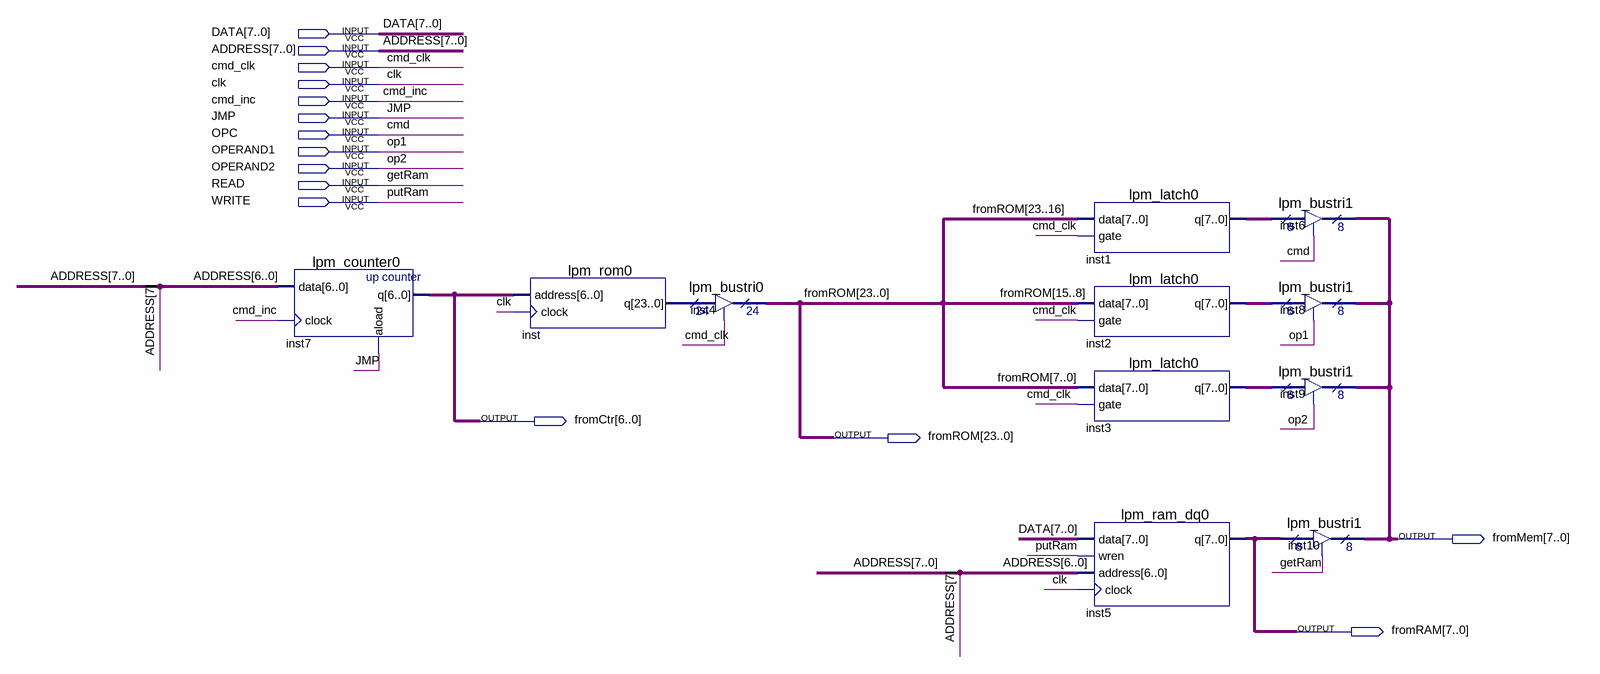
[diagram p0: schematic sheet]
// Quartus schematic mem.bdf as structural Verilog: 11 symbols, 15 pins
module mem (
  input  [7:0] DATA,
  input  [7:0] ADDRESS,
  input  cmd_clk,
  input  clk,
  input  cmd_inc,
  input  JMP,
  input  OPC,
  input  OPERAND1,
  input  OPERAND2,
  input  READ,
  input  WRITE,
  output [6:0] fromCtr,
  output [23:0] fromROM,
  output [7:0] fromMem,
  output [7:0] fromRAM
);

  wire [7:0] inst1_q, inst2_q, inst3_q;
  wire [23:0] inst_q;

  lpm_counter0 inst7 (.data(ADDRESS[6:0]), .clock(cmd_inc), .aload(JMP), .q(fromCtr));
  lpm_rom0 inst (.address(fromCtr), .clock(clk), .q(inst_q));
  lpm_bustri0 inst4 (.enabledt(cmd_clk), .data(inst_q), .tridata(fromROM));
  lpm_latch0 inst1 (.data(fromROM[23:16]), .gate(cmd_clk), .q(inst1_q));
  lpm_latch0 inst2 (.data(fromROM[15:8]), .gate(cmd_clk), .q(inst2_q));
  lpm_latch0 inst3 (.data(fromROM[7:0]), .gate(cmd_clk), .q(inst3_q));
  lpm_ram_dq0 inst5 (.data(DATA), .wren(WRITE), .address(ADDRESS[6:0]), .clock(clk), .q(fromRAM));
  lpm_bustri1 inst6 (.enabledt(OPC), .data(inst1_q), .tridata(fromMem));
  lpm_bustri1 inst8 (.enabledt(OPERAND1), .data(inst2_q), .tridata(fromMem));
  lpm_bustri1 inst9 (.enabledt(OPERAND2), .data(inst3_q), .tridata(fromMem));
  lpm_bustri1 inst10 (.enabledt(READ), .data(fromRAM), .tridata(fromMem));

  // Other names for the same wires on the sheet: cmd = OPC; getRam = READ; op1 = OPERAND1; op2 = OPERAND2;
  //   putRam = WRITE
endmodule
